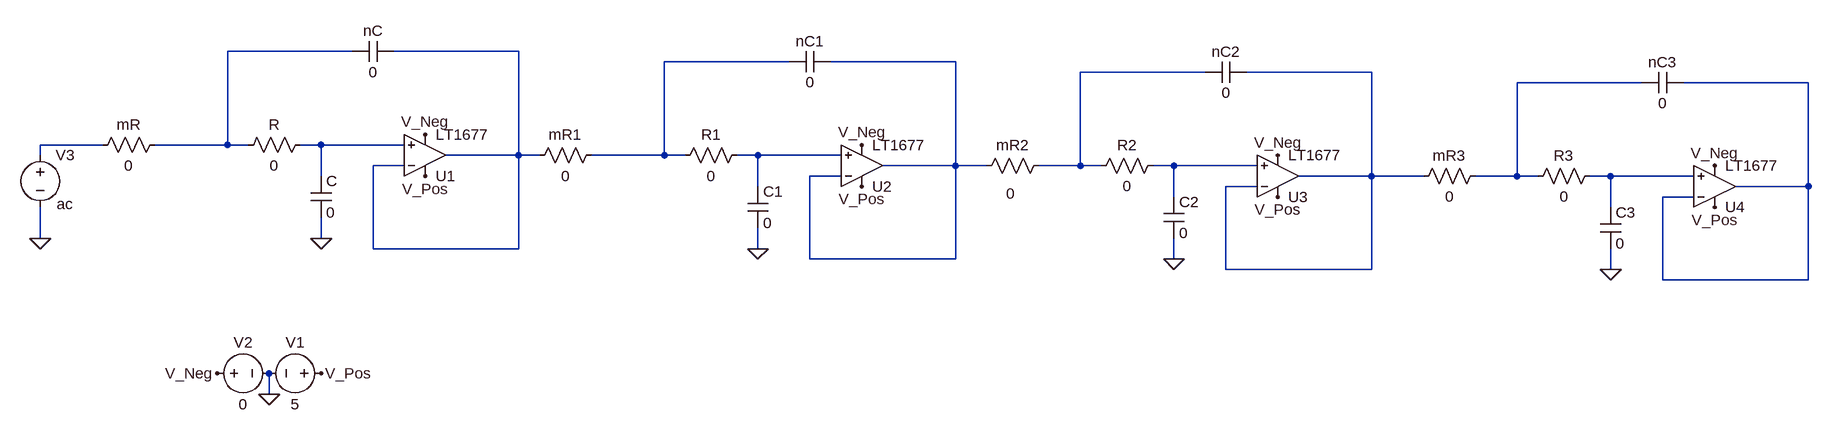
[diagram p0: schematic UnityGain8thOrderFilter.asc]
UnityGain8thOrderFilter.asc, the LTspice schematic file:
Version 4
SHEET 1 2600 680
WIRE 352 -80 160 -80
WIRE 608 -80 416 -80
WIRE 1024 -64 832 -64
WIRE 1280 -64 1088 -64
WIRE 1664 -48 1472 -48
WIRE 1920 -48 1728 -48
WIRE 2336 -32 2144 -32
WIRE 2592 -32 2400 -32
WIRE -32 64 -128 64
WIRE 160 64 160 -80
WIRE 160 64 48 64
WIRE 192 64 160 64
WIRE 304 64 272 64
WIRE 432 64 304 64
WIRE -128 80 -128 64
WIRE 608 80 608 -80
WIRE 608 80 496 80
WIRE 640 80 608 80
WIRE 832 80 832 -64
WIRE 832 80 720 80
WIRE 864 80 832 80
WIRE 976 80 944 80
WIRE 1104 80 976 80
WIRE 432 96 384 96
WIRE 1280 96 1280 -64
WIRE 1280 96 1168 96
WIRE 1328 96 1280 96
WIRE 1472 96 1472 -48
WIRE 1472 96 1408 96
WIRE 1504 96 1472 96
WIRE 1616 96 1584 96
WIRE 1744 96 1616 96
WIRE 304 112 304 64
WIRE 1104 112 1056 112
WIRE 1920 112 1920 -48
WIRE 1920 112 1808 112
WIRE 2000 112 1920 112
WIRE 2144 112 2144 -32
WIRE 2144 112 2080 112
WIRE 2176 112 2144 112
WIRE 2288 112 2256 112
WIRE 2416 112 2288 112
WIRE 976 128 976 80
WIRE 1744 128 1696 128
WIRE 2592 128 2592 -32
WIRE 2592 128 2480 128
WIRE 1616 144 1616 96
WIRE 2416 144 2368 144
WIRE 2288 160 2288 112
WIRE -128 208 -128 160
WIRE 304 208 304 176
WIRE 384 224 384 96
WIRE 608 224 608 80
WIRE 608 224 384 224
WIRE 976 224 976 192
WIRE 1056 240 1056 112
WIRE 1280 240 1280 96
WIRE 1280 240 1056 240
WIRE 1616 240 1616 208
WIRE 1696 256 1696 128
WIRE 1920 256 1920 112
WIRE 1920 256 1696 256
WIRE 2288 256 2288 224
WIRE 2368 272 2368 144
WIRE 2592 272 2592 128
WIRE 2592 272 2368 272
WIRE 224 448 224 416
FLAG 224 448 0
FLAG 304 416 V_Pos
FLAG 144 416 V_Neg
FLAG 304 208 0
FLAG -128 208 0
FLAG 464 112 V_Pos
FLAG 464 48 V_Neg
FLAG 976 224 0
FLAG 1136 128 V_Pos
FLAG 1136 64 V_Neg
FLAG 1616 240 0
FLAG 1776 144 V_Pos
FLAG 1776 80 V_Neg
FLAG 2288 256 0
FLAG 2448 160 V_Pos
FLAG 2448 96 V_Neg
SYMBOL voltage 320 416 R90
WINDOW 0 -32 56 VBottom 2
WINDOW 3 32 56 VTop 2
SYMATTR InstName V1
SYMATTR Value 5
SYMBOL voltage 128 416 R270
WINDOW 0 32 56 VTop 2
WINDOW 3 -32 56 VBottom 2
SYMATTR InstName V2
SYMATTR Value 0
SYMBOL cap 288 112 R0
SYMATTR InstName C
SYMATTR Value 0
SYMBOL res 288 48 R90
WINDOW 0 0 56 VBottom 2
WINDOW 3 32 56 VTop 2
SYMATTR InstName R
SYMATTR Value 0
SYMBOL cap 416 -96 R90
WINDOW 0 0 32 VBottom 2
WINDOW 3 32 32 VTop 2
SYMATTR InstName nC
SYMATTR Value 0
SYMBOL res 64 48 R90
WINDOW 0 0 56 VBottom 2
WINDOW 3 32 56 VTop 2
SYMATTR InstName mR
SYMATTR Value 0
SYMBOL voltage -128 64 R0
WINDOW 123 0 0 Left 0
WINDOW 39 0 0 Left 0
WINDOW 3 25 91 Left 2
SYMATTR InstName V3
SYMATTR Value ac
SYMBOL Opamps\\LT1677 464 144 M180
SYMATTR InstName U1
SYMBOL cap 960 128 R0
SYMATTR InstName C1
SYMATTR Value 0
SYMBOL res 960 64 R90
WINDOW 0 0 56 VBottom 2
WINDOW 3 32 56 VTop 2
SYMATTR InstName R1
SYMATTR Value 0
SYMBOL cap 1088 -80 R90
WINDOW 0 0 32 VBottom 2
WINDOW 3 32 32 VTop 2
SYMATTR InstName nC1
SYMATTR Value 0
SYMBOL res 736 64 R90
WINDOW 0 0 56 VBottom 2
WINDOW 3 32 56 VTop 2
SYMATTR InstName mR1
SYMATTR Value 0
SYMBOL Opamps\\LT1677 1136 160 M180
SYMATTR InstName U2
SYMBOL cap 1600 144 R0
SYMATTR InstName C2
SYMATTR Value 0
SYMBOL res 1600 80 R90
WINDOW 0 0 56 VBottom 2
WINDOW 3 32 56 VTop 2
SYMATTR InstName R2
SYMATTR Value 0
SYMBOL cap 1728 -64 R90
WINDOW 0 0 32 VBottom 2
WINDOW 3 32 32 VTop 2
SYMATTR InstName nC2
SYMATTR Value 0
SYMBOL res 1424 80 R90
WINDOW 0 0 56 VBottom 2
WINDOW 3 43 59 VTop 2
SYMATTR InstName mR2
SYMATTR Value 0
SYMBOL Opamps\\LT1677 1776 176 M180
SYMATTR InstName U3
SYMBOL cap 2272 160 R0
SYMATTR InstName C3
SYMATTR Value 0
SYMBOL res 2272 96 R90
WINDOW 0 0 56 VBottom 2
WINDOW 3 32 56 VTop 2
SYMATTR InstName R3
SYMATTR Value 0
SYMBOL cap 2400 -48 R90
WINDOW 0 0 32 VBottom 2
WINDOW 3 32 32 VTop 2
SYMATTR InstName nC3
SYMATTR Value 0
SYMBOL res 2096 96 R90
WINDOW 0 0 56 VBottom 2
WINDOW 3 32 56 VTop 2
SYMATTR InstName mR3
SYMATTR Value 0
SYMBOL Opamps\\LT1677 2448 192 M180
SYMATTR InstName U4

The netlist it stands for:
* UnityGain8thOrderFilter.asc
V1 V_Pos 0 5
V2 V_Neg 0 0
C N010 0 0
R N010 N001 0
C§nC N002 N001 0
R§mR N001 N009 0
V3 N009 0 ac
XU1 N010 N002 V_Pos V_Neg N002 LT1677  ; pins In+ In- V+ V- OUT
C1 N011 0 0
R1 N011 N003 0
C§nC1 N004 N003 0
R§mR1 N003 N002 0
XU2 N011 N004 V_Pos V_Neg N004 LT1677  ; pins In+ In- V+ V- OUT
C2 N012 0 0
R2 N012 N005 0
C§nC2 N006 N005 0
R§mR2 N005 N004 0
XU3 N012 N006 V_Pos V_Neg N006 LT1677  ; pins In+ In- V+ V- OUT
C3 N013 0 0
R3 N013 N007 0
C§nC3 N008 N007 0
R§mR3 N007 N006 0
XU4 N013 N008 V_Pos V_Neg N008 LT1677  ; pins In+ In- V+ V- OUT
.lib LTC.lib
.backanno
.end